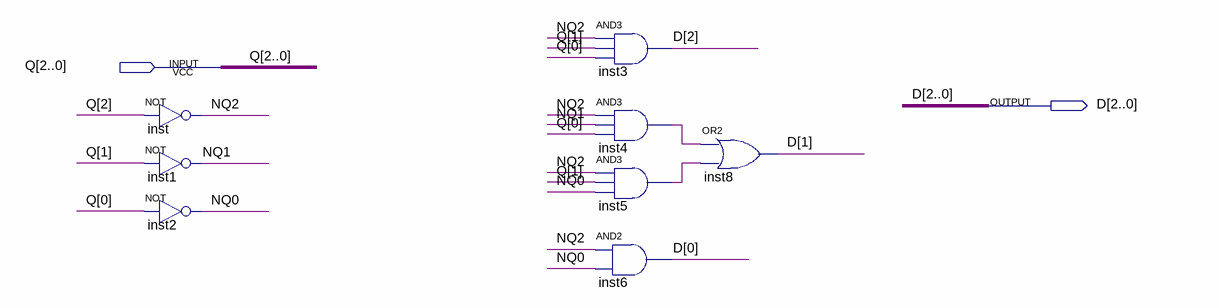
[diagram p0: schematic sheet]
// Quartus schematic NEW_NEXTSTATE.bdf as structural Verilog: 8 symbols, 2 pins
module NEW_NEXTSTATE (
  input  [2:0] Q,
  output [2:0] D
);

  wire inst4_out, inst5_out, NQ0, NQ1, NQ2;

  not inst (NQ2, Q[2]);
  not inst1 (NQ1, Q[1]);
  not inst2 (NQ0, Q[0]);
  and inst3 (D[2], NQ2, Q[1], Q[0]);
  and inst4 (inst4_out, NQ2, NQ1, Q[0]);
  and inst5 (inst5_out, NQ2, Q[1], NQ0);
  and inst6 (D[0], NQ2, NQ0);
  or inst8 (D[1], inst4_out, inst5_out);
endmodule
